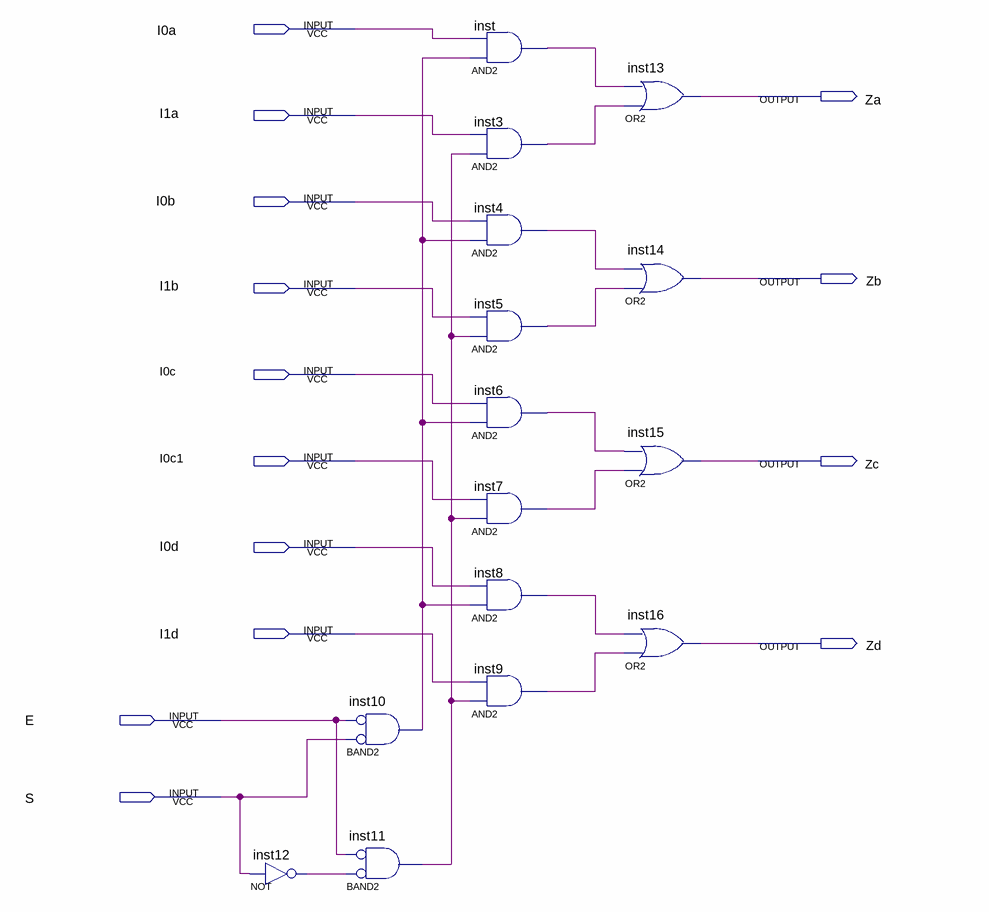
[diagram p0: schematic sheet]
// Quartus schematic 74LS157.bdf as structural Verilog: 15 symbols, 14 pins
module \74LS157  (
  input  I0a,
  input  I1a,
  input  I0b,
  input  I1b,
  input  I0c,
  input  I0c1,
  input  I0d,
  input  I1d,
  input  E,
  input  S,
  output Za,
  output Zb,
  output Zc,
  output Zd
);

  wire inst3_out, inst4_out, inst5_out, inst6_out, inst7_out, inst8_out, inst9_out, inst10_out, inst11_out,
       inst12_out, inst_out;

  not inst12 (inst12_out, S);
  and inst10 (inst10_out, ~S, ~E);  // BAND2
  and inst11 (inst11_out, ~inst12_out, ~E);  // BAND2
  and inst (inst_out, inst10_out, I0a);
  and inst3 (inst3_out, inst11_out, I1a);
  and inst4 (inst4_out, inst10_out, I0b);
  and inst5 (inst5_out, inst11_out, I1b);
  and inst6 (inst6_out, inst10_out, I0c);
  and inst7 (inst7_out, inst11_out, I0c1);
  and inst8 (inst8_out, inst10_out, I0d);
  and inst9 (inst9_out, inst11_out, I1d);
  or inst13 (Za, inst3_out, inst_out);
  or inst14 (Zb, inst5_out, inst4_out);
  or inst15 (Zc, inst7_out, inst6_out);
  or inst16 (Zd, inst9_out, inst8_out);
endmodule
